# Altium schematic sheet Overview.SchDoc
size A
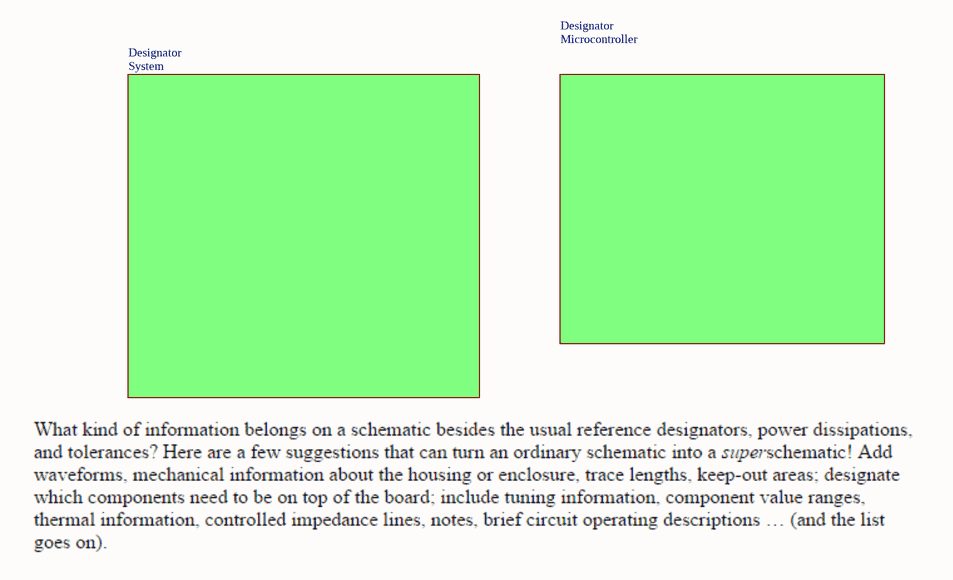
[diagram p0: Overview.SchDoc]

## Sub-sheets
Designator = System: no entries
Designator = Microcontroller: no entries